# Altium schematic sheet 51 最小系统.SchDoc
size A4
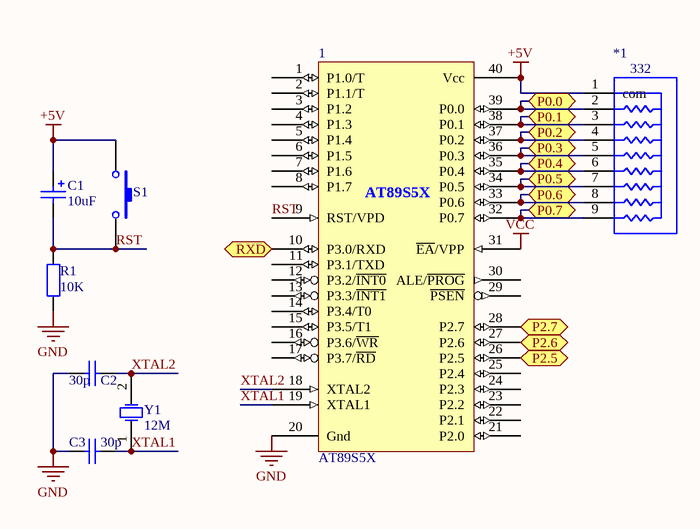
[diagram p0: 51 最小系统.SchDoc]

## Parts
1  AT89S5X  [DIP-40]
*1  排阻 DIP-9  [HDR1X9]  (value not drawn)
C1  电解电容  [电解电容]  (value not drawn)
C2  瓷片电容  [瓷片电容]  (value not drawn)
C3  瓷片电容  [瓷片电容]  (value not drawn)
R1  value 10K  [AXIAL-0.4]  (hidden comment: Res2)
S1  SW-PB  [SPST-2]  (value not drawn)
Y1  12M  [R38]

## Ports
P0.0, P0.1, P0.2, P0.3, P0.4, P0.5, P0.6, P0.7, P2.5, P2.6, P2.7, RXD (in)

## Nets
+5V: 1.40(Vcc) *1.1(com) C1.1 S1.1
GND: 1.20(Gnd) C2.1 C3.1 R1.1
VCC: 1.31(~{EA}/VPP)
P0.0: 1.39(P0.0) *1.2 ; port P0.0
P0.1: 1.38(P0.1) *1.3 ; port P0.1
P0.2: 1.37(P0.2) *1.4 ; port P0.2
P0.3: 1.36(P0.3) *1.5 ; port P0.3
P0.4: 1.35(P0.4) *1.6 ; port P0.4
P0.5: 1.34(P0.5) *1.7 ; port P0.5
P0.6: 1.33(P0.6) *1.8 ; port P0.6
P0.7: 1.32(P0.7) *1.9 ; port P0.7
P2.5: 1.26(P2.5) ; port P2.5
P2.6: 1.27(P2.6) ; port P2.6
P2.7: 1.28(P2.7) ; port P2.7
RST: 1.9(RST/VPD) C1.2 R1.2 S1.2
RXD: 1.10(P3.0/RXD) ; port RXD
XTAL1: 1.19(XTAL1) C3.2 Y1.1(OSC1)
XTAL2: 1.18(XTAL2) C2.2 Y1.2(OSC2)

Not connected (* = marked no-connect by the designer): 1 1(P1.0/T) 2(P1.1/T) 3(P1.2) 4(P1.3) 5(P1.4) 6(P1.5) 7(P1.6) 8(P1.7) 11(P3.1/TXD) 12(P3.2/~{INT0}) 13(P3.3/~{INT1}) 14(P3.4/T0) 15(P3.5/T1) 16(P3.6/~{WR}) 17(P3.7/~{RD}) 21(P2.0) 22(P2.1) 23(P2.2) 24(P2.3) 25(P2.4) 29(~{PSEN}) 30(ALE/~{PROG})

## Notes on the sheet
- 标题
- 日期
- 红外数字模拟接收一体机
- 2015 5 29
- 作者
- 模电组
- 单位
- 电子技术协会
- (in symbol 排阻 DIP-9) 332
- (in symbol 瓷片电容) 30p
- (in symbol 电解电容) 10uF

## Library data of the parts
R1 = Res2: Resistor; Published: 8-Jun-2000; LatestRevisionDate: 17-Jul-2002; LatestRevisionNote: Re-released for DXP Platform.; PackageReference: AXIAL-0.4; Publisher: Altium Limited
S1 = SW-PB: Switch; Published: 24-Mar-1999; LatestRevisionDate: 17-Jul-2002; LatestRevisionNote: Re-released for DXP Platform.; PackageReference: SPST-2; Publisher: Altium Limited
Y1 = XTAL: Crystal Oscillator; Published: 8-Jun-2000; LatestRevisionDate: 17-Jul-2002; LatestRevisionNote: Re-released for DXP Platform.; PackageReference: R38; Publisher: Altium Limited